# Altium schematic sheet ESP8266 Schematic.schDoc
size A4; SheetNumber: 1; SheetTotal: 1
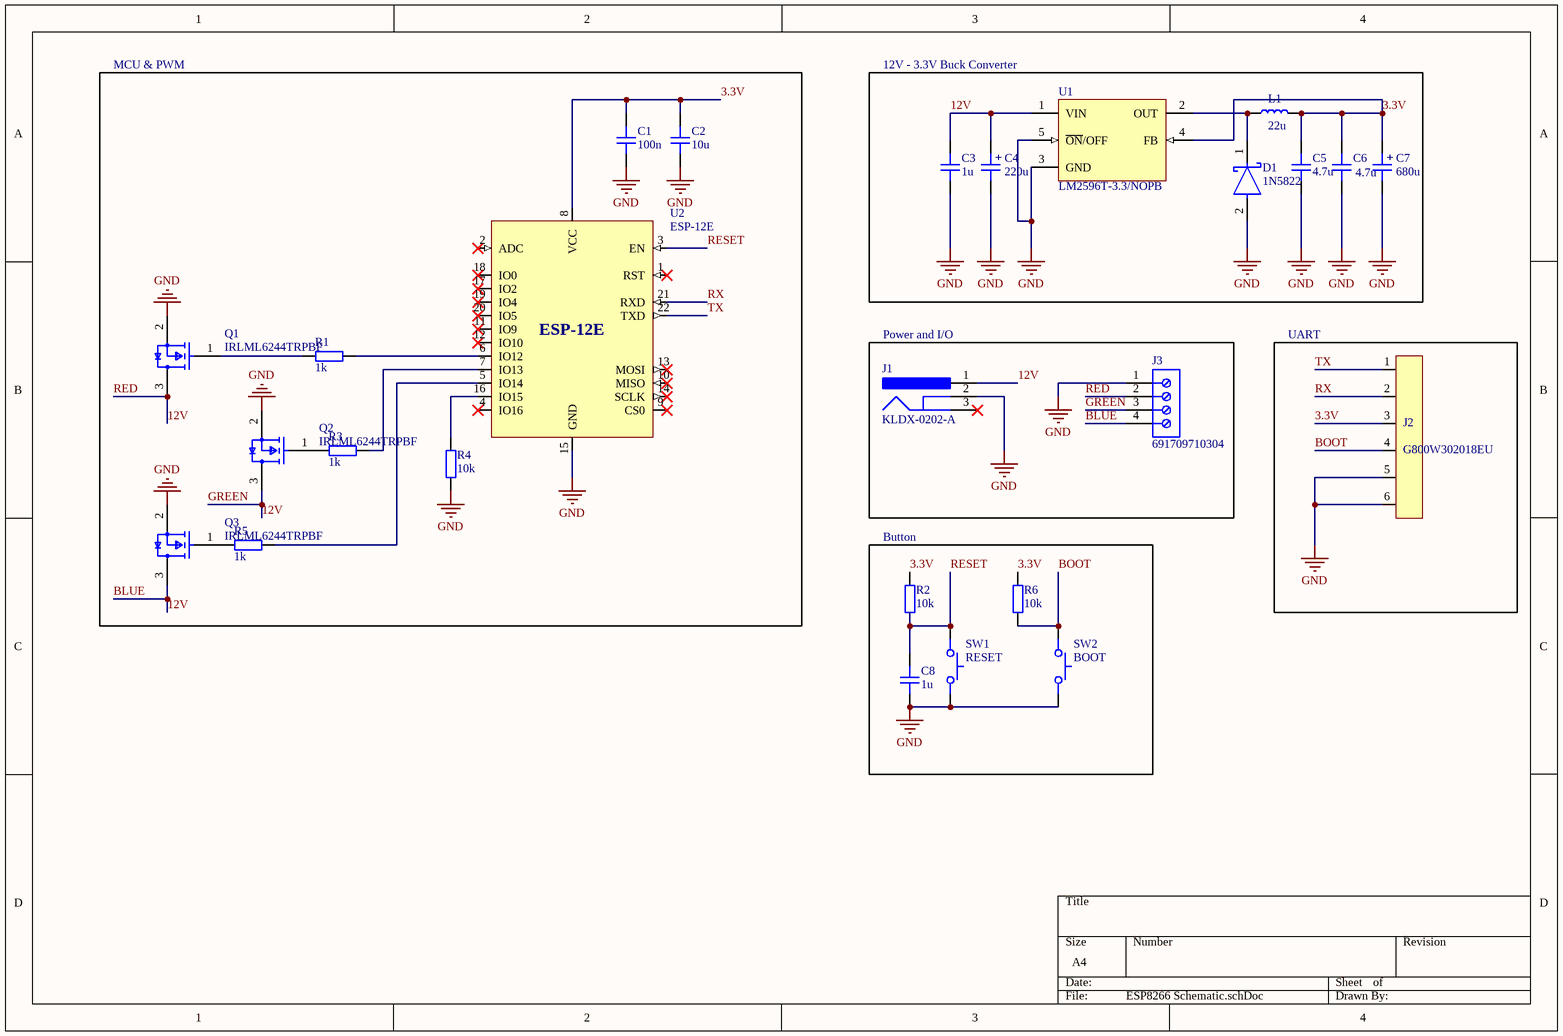
[diagram p0: ESP8266 Schematic.schDoc]

## Parts
C1  100n  [CAP_0402]
C2  10u  [CAP_0402]
C3  1u  [CAP_0402]
C4  220u  [CAP_AE_SMD_D6MM3_H5M55]
C5  4.7u  [CAP_0402]
C6  4.7u  [CAP_0402]
C7  680u  [CAP_AE_SMD_D6MM3_H5M55]
C8  1u  [CAP_0402]
D1  1N5822  [FP-DO-201AD-MFG]
J1  KLDX-0202-A  [KYCN-KLDX-0202-A_V]
J2  G800W302018EU  [G800W302018EU]
J3  691709710304  [691709710304]
L1  22u  [IND_0402]
Q1  IRLML6244TRPBF  [FP-Micro3-IPC_C]
Q2  IRLML6244TRPBF  [FP-Micro3-IPC_C]
Q3  IRLML6244TRPBF  [FP-Micro3-IPC_C]
R1  1k  [RES_0201]
R2  10k  [RES_0201]
R3  1k  [RES_0201]
R4  10k  [RES_0201]
R5  1k  [RES_0201]
R6  10k  [RES_0201]
SW1  RESET  [SKRPANE010]
SW2  BOOT  [SKRPANE010]
U1  LM2596T-3.3/NOPB  [NDH0005A]
U2  ESP-12E  [ESP-12E]

## Blocks framed on the sheet
MCU & PWM: C1 C2 Q1-Q3 R1 R3-R5 U2
12V - 3.3V Buck Converter: C3-C7 D1 L1 U1
Power and I/O: J1 J3
UART: J2
Button: C8 R2 R6 SW1 SW2

## Nets
GND: C1.2 C2.2 C3.2 C4.2 C5.2 C6.2 C7.2 C8.2 D1.2(A) J1.2 J2.5 J2.6 J3.1 Q1.2(S) Q2.2(S) Q3.2(S) R4.2 SW1.34 SW2.34 U1.3(GND) U1.5(~{ON}/OFF) U2.15(GND)
3.3V: C1.1 C2.1 C5.1 C6.1 C7.1 J2.3 L1.2 R2.2 R6.2 U1.4(FB) U2.8(VCC)
12V: C3.1 C4.1 J1.1 J3.2 J3.3 J3.4 Q1.3(D) Q2.3(D) Q3.3(D) U1.1(VIN)  [also labelled BLUE, GREEN, RED]
BOOT: J2.4 R6.1 SW2.12
RESET: C8.1 R2.1 SW1.12 U2.3(EN)
RX: J2.2 U2.21(RXD)
TX: J2.1 U2.22(TXD)
NetD1_1: D1.1(C) L1.1 U1.2(OUT)
NetQ1_1: Q1.1(G) R1.2
NetQ2_1: Q2.1(G) R3.2
NetQ3_1: Q3.1(G) R5.2
NetR1_1: R1.1 U2.6(IO12)
NetR3_1: R3.1 U2.7(IO13)
NetR4_1: R4.1 U2.16(IO15)
NetR5_1: R5.1 U2.5(IO14)

Not connected (* = marked no-connect by the designer): J1 3*; U2 1(RST)* 2(ADC)* 4(IO16)* 9(CS0)* 10(MISO)* 11(IO9)* 12(IO10)* 13(MOSI)* 14(SCLK)* 17(IO2)* 18(IO0)* 19(IO4)* 20(IO5)*

## Notes on the sheet
- (in symbol CAP_ALEL_6.3x5.5) +

## Library data of the parts
C1-C3 C5 C6 C8 = CAP_0402: Capacitor SMD 0402; Manufacturer: *; Manufacturer Part Number: *; Distributor Link: *; LCSC: *; Rating: *; Dielectric: *
C4 C7 = CAP_ALEL_6.3x5.5: Capacitor SMD Aluminium Electrolytic 6.3mm Diameter 5.5mm Height; Manufacturer: *; Manufacturer Part Number: *; Distributor Link: *; LCSC: *
D1 = CMP-12187-000025-1: DIODE SCHOTTKY 40V 3A DO201AD; Manufacturer: STMicroelectronics; Max Junction Temp: +150°C; Peak Reverse Current: 2mA; Max Surge Forward Current: 80A; Temperature Range High: +150°C; Automotive: No; RoHS: TRUE; ComponentLink2Description: Datasheet; Manufacturer Part Number: 1N5822; Lead Free: Yes; Octopart: https://octopart.com/1n5822-stmicroelectronics-323225; Device Class L2: Diodes; Max Repetitive Reverse Voltage: 40V; Temperature: to +150°C; Height: 5.3mm; Category: Diode; Digikey Description: DIODE SCHOTTKY 40V 3A DO201AD; ComponentLink2URL: https://www.st.com/resource/en/datasheet/1n5822.pdf; Device Class L3: Schottky Diodes; Device Class L1: Discrete Semiconductors; Forward Current: 3A; Mouser Description: Schottky Diodes & Rectifiers Vr/40V Io/3A BULK; Package: DO-201AD
J1 = CMP-1673-00001-5: DC Power Jack, 24 V, 3.5 A, -25 to 85 degC, 3-Pin THD, RoHS; Manufacturer: Kycon; Voltage Rating: 24 V; Current Rating: 3.5 A; Height: 10.8 mm; Length: 9.2 mm; Pins: 2; Housing Material: PBT; Connector Type: Power; ComponentLink2URL: http://www.kycon.com/Pub_Eng_Draw/KLDX-0202-X.PDF; PackageDescription: 3-Pin Through Hole Device, Body 14.5 x 9 mm; Max Operating Temperature: 85 degC; Min Operating Temperature: -25 degC; PackageReference: KLDX-0202-A; Contact Gender: Female; Package Quantity: 500; Mount: Through Hole; Colour: Black; Contact Plating: Tin; DatasheetVersion: Rev. D3, 06/2013; ComponentLink2Description: Datasheet; RoHSCompliant: true; Mounting Technology: Through Hole; ComponentLink1Description: Manufacturer URL; Contact Material: Brass; ComponentLink1URL: http://www.kycon.com/
J2 = G800W302018EU: Pin Header 6 Position 2.54mm Pitch; Manufacturer: Amphenol; Manufacturer Part Number: G800W302018EU
J3 = CMP-1502-03337-2: NexarPartId: 34171771; Current: 6A; Voltage: 300V; Number of Positions Per Level: 4; Plating: Steel; Wire Gauge (Max): 30AWG; Pitch: 5mm; Connector Type: Screw; Number of Levels: 1; Color: Black; Lead Pitch: 5mm; Mount: Surface Mount; Flammability Rating: UL94 V-0; Termination: Screw; Housing Material: Nylon; Min Operating Temperature: -40°C; REACH SVHC: Unknown; Number of Pins: 4; Contact Plating: Tin; Packaging: Digi-Reel®; Height: 10.2mm; Number of Rows: 1; Number of Positions: 4; Contact Material: Nickel; Current Rating: 6A; Wire Gauge (Min): 30AWG; Voltage Rating: 300V; Length: 20mm; Wire/Cable Gauge: 30AWG; RoHS: Compliant; Number of Contacts: 4; Max Operating Temperature: 130°C
L1 = IND_0402: Inductor SMD 0402
Q1-Q3 = CMP-32901-000185-1: MOSFET N-CH 20V 6.3A SOT-23; Max Power Dissipation: 1.3W; Rds On Max: 21mR; Input Capacitance: 700pF; Threshold Voltage: 900mV; Halogen Free: Halogen Free; Drain to Source Voltage (Vdss): 20V; Max Operating Temperature: 150°C; Case/Package: SOT-23; Mount: Surface Mount; Continuous Drain Current (ID): 6.3A; Number of Pins: 3; Lead Free: Lead Free; Packaging: Tape and Reel; Min Operating Temperature: -55°C; Max Dual Supply Voltage: 20V; REACH SVHC: No SVHC
R1-R6 = RES_0201: Resistor SMD 0201; Manufacturer: *; Manufacturer Part Number: *; Distributor Link: *; LCSC: *
SW1 SW2 = SKRPANE010: Tactile Switch SMD SPST; Manufacturer: Alps Alpine; Manufacturer Part Number: SKRPANE010
U1 = CMP-0069-01930-3: SIMPLE SWITCHER® Power Converter 150 KHz 3A Step-Down Voltage Regulator, 5-pin TO-220, Pb-Free; Manufacturer: Texas Instruments; PowerWise: N; PackageTopMarking: NSUZXYTTE#*LM2596T*-3.3 P+; PackageReference: NDH0005A; PackageDescription: TO-220, Molded, Stagger Bend, 5 Lead; ComponentLink1URL: http://www.ti.com/general/docs/lit/getliterature.tsp?genericPartNumber=LM2596&fileType=pdf; ComponentLink1Description: Datasheet URL; PinCount: 5; CompType: Switcher; RoHS: Y
U2 = ESP-12E: ESP8266 ESP-12E Module (ESP8266, Castellated Holes); Manufacturer: AI-THINKER; Manufacturer Part Number: ESP-12E; Distributor Link: *